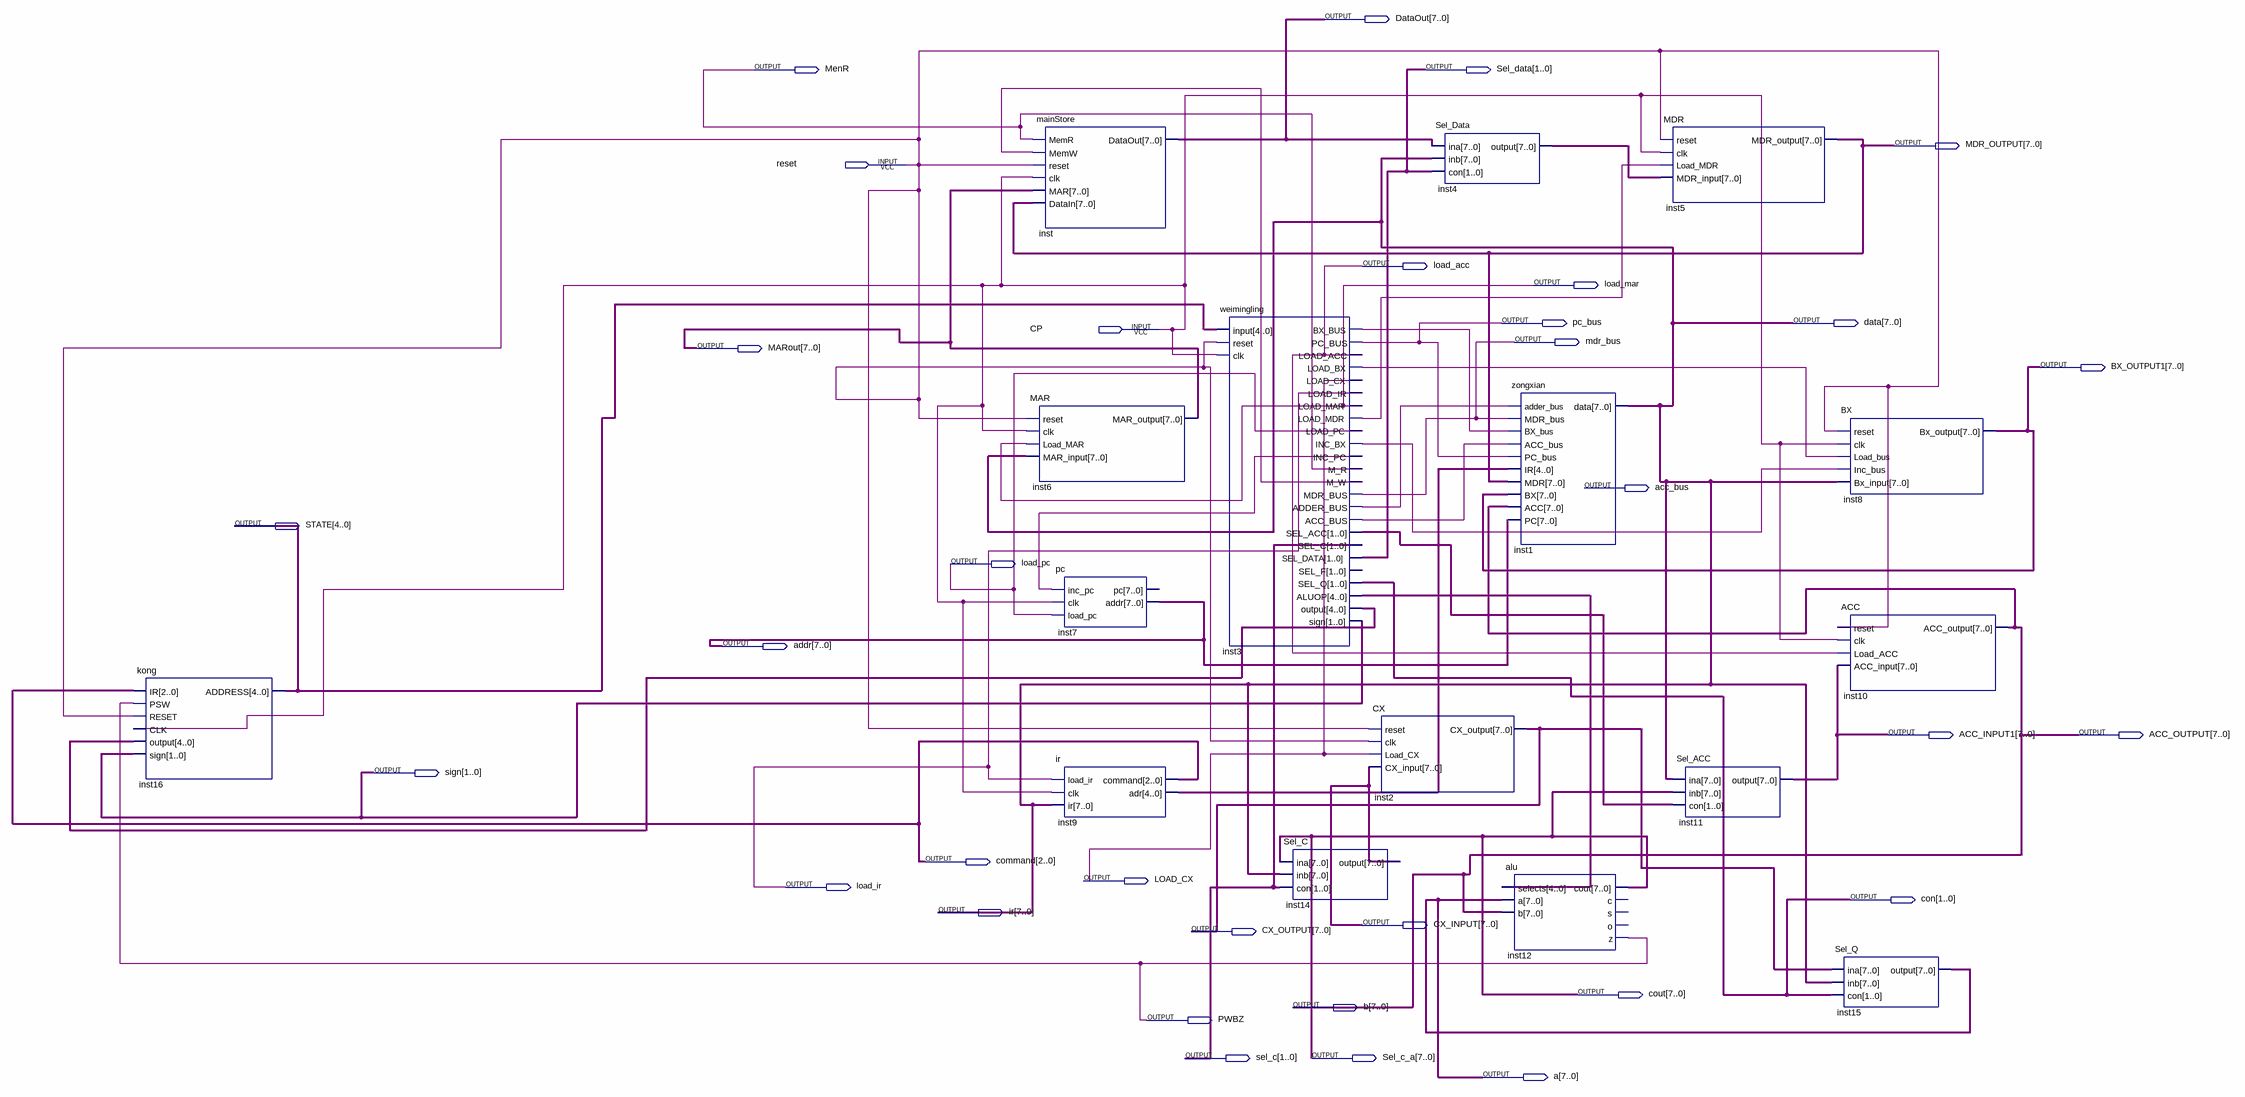
[diagram p0: schematic sheet]
// Quartus schematic Block1.bdf as structural Verilog: 16 symbols, 33 pins
module Block1 (
  input  reset,
  input  CP,
  output [7:0] DataOut,
  output MenR,
  output [1:0] Sel_data,
  output [7:0] MDR_OUTPUT,
  output load_acc,
  output load_mar,
  output pc_bus,
  output [7:0] data,
  output mdr_bus,
  output [7:0] MARout,
  output [7:0] BX_OUTPUT1,
  output acc_bus,
  output [4:0] STATE,
  output load_pc,
  output [7:0] addr,
  output [7:0] ACC_INPUT1,
  output [7:0] ACC_OUTPUT,
  output [1:0] sign,
  output [2:0] command,
  output LOAD_CX,
  output load_ir,
  output [1:0] con,
  output [7:0] ir,
  output [7:0] CX_INPUT,
  output [7:0] CX_OUTPUT,
  output [7:0] cout,
  output [7:0] b,
  output PWBZ,
  output [1:0] sel_c,
  output [7:0] Sel_c_a,
  output [7:0] a
);

  wire inst3_acc_bus, inst3_adder_bus, inst3_bx_bus, inst3_inc_bx, inst3_inc_pc, inst3_load_bx,
       inst3_load_mdr, inst3_m_w;
  wire [1:0] inst3_sel_acc;
  wire [4:0] inst3_aluop, inst3_output, inst9_adr;
  wire [7:0] inst4_output;

  kong inst16 (
    .IR(command), .PSW(PWBZ), .RESET(reset), .CLK(CP), .\output (inst3_output), .sign(sign), .ADDRESS(STATE));
  mainStore inst (
    .MemR(MenR), .MemW(inst3_m_w), .reset(reset), .clk(CP), .MAR(MARout), .DataIn(MDR_OUTPUT),
    .DataOut(DataOut));
  MAR inst6 (.reset(reset), .clk(CP), .Load_MAR(load_mar), .MAR_input(data), .MAR_output(MARout));
  pc inst7 (.inc_pc(inst3_inc_pc), .clk(CP), .load_pc(load_pc), .addr(addr));  // open: pc
  ir inst9 (.load_ir(load_ir), .clk(CP), .ir(data), .command(command), .adr(inst9_adr));
  weimingling inst3 (
    .\input (STATE), .reset(reset), .clk(CP), .BX_BUS(inst3_bx_bus), .PC_BUS(pc_bus), .LOAD_ACC(load_acc),
    .LOAD_BX(inst3_load_bx), .LOAD_CX(LOAD_CX), .LOAD_IR(load_ir), .LOAD_MAR(load_mar),
    .LOAD_MDR(inst3_load_mdr), .LOAD_PC(load_pc), .INC_BX(inst3_inc_bx), .INC_PC(inst3_inc_pc), .M_R(MenR),
    .M_W(inst3_m_w), .MDR_BUS(mdr_bus), .ADDER_BUS(inst3_adder_bus), .ACC_BUS(inst3_acc_bus),
    .SEL_ACC(inst3_sel_acc), .SEL_C(sel_c), .SEL_DATA(Sel_data), .SEL_Q(con), .ALUOP(inst3_aluop),
    .\output (inst3_output), .sign(sign));  // open: SEL_F
  Sel_C inst14 (.ina(cout), .inb(data), .con(sel_c), .\output (CX_INPUT));
  CX inst2 (.reset(reset), .clk(reset), .Load_CX(LOAD_CX), .CX_input(CX_INPUT), .CX_output(CX_OUTPUT));
  Sel_Data inst4 (.ina(DataOut), .inb(data), .con(Sel_data), .\output (inst4_output));
  zongxian inst1 (
    .adder_bus(inst3_adder_bus), .MDR_bus(mdr_bus), .BX_bus(inst3_bx_bus), .ACC_bus(inst3_acc_bus),
    .PC_bus(pc_bus), .IR(inst9_adr), .MDR(MDR_OUTPUT), .BX(BX_OUTPUT1), .ACC(ACC_OUTPUT), .PC(addr),
    .data(data));
  alu inst12 (.selects(inst3_aluop), .a(a), .b(ACC_OUTPUT), .cout(cout), .z(PWBZ));  // open: c, s, o
  MDR inst5 (.reset(reset), .clk(CP), .Load_MDR(inst3_load_mdr), .MDR_input(inst4_output), .MDR_output(MDR_OUTPUT));
  Sel_ACC inst11 (.ina(data), .inb(cout), .con(inst3_sel_acc), .\output (ACC_INPUT1));
  BX inst8 (
    .reset(reset), .clk(CP), .Load_bus(inst3_load_bx), .Inc_bus(inst3_inc_bx), .Bx_input(data),
    .Bx_output(BX_OUTPUT1));
  ACC inst10 (.reset(reset), .clk(CP), .Load_ACC(load_acc), .ACC_input(ACC_INPUT1), .ACC_output(ACC_OUTPUT));
  Sel_Q inst15 (.ina(CX_OUTPUT), .inb(data), .con(con), .\output (a));

  assign b = ACC_OUTPUT;
  assign ir = data;
  assign Sel_c_a = cout;
endmodule
